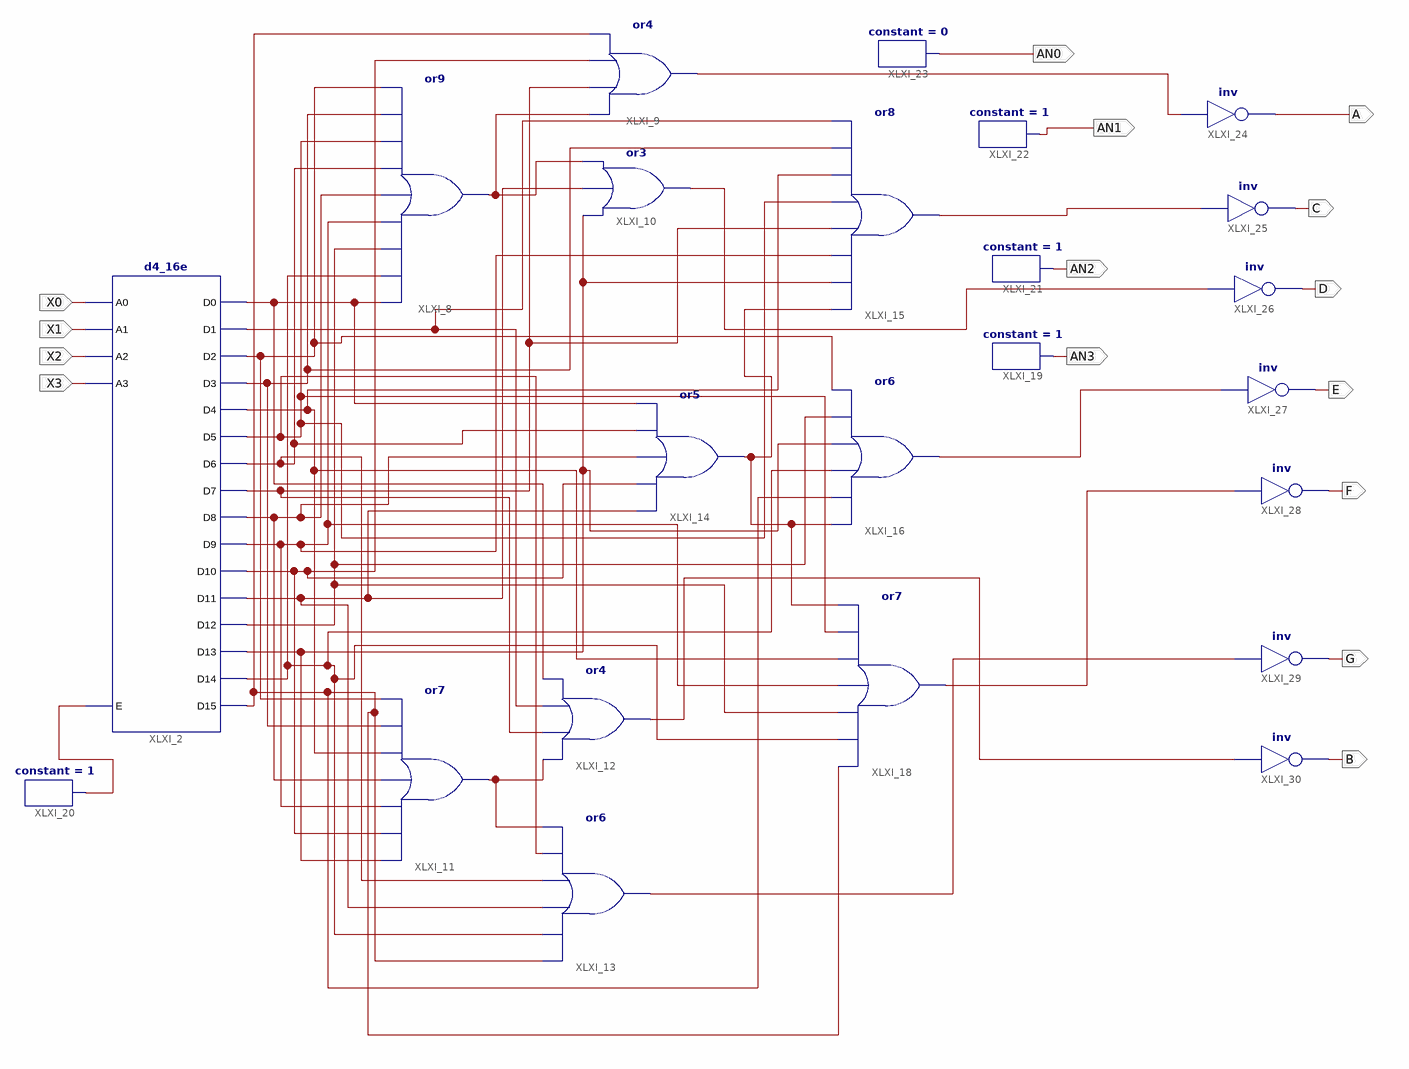
[diagram p0: schematic sheet 1]
// Xilinx ISE schematic Assignment3.sch (spartan6) as structural Verilog: 23 symbols, 15 ports
module Assignment3 (
  input  X0,
  input  X1,
  input  X2,
  input  X3,
  output AN0,
  output AN1,
  output AN2,
  output AN3,
  output A,
  output C,
  output E,
  output D,
  output F,
  output G,
  output B
);

  wire XLXN_10, XLXN_11, XLXN_14, XLXN_15, XLXN_17, XLXN_20, XLXN_22, XLXN_23, XLXN_25, XLXN_26, XLXN_27,
       XLXN_28, XLXN_29, XLXN_30, XLXN_31, XLXN_33, XLXN_34, XLXN_37, XLXN_40, XLXN_49, XLXN_56, XLXN_57,
       XLXN_64, XLXN_65, XLXN_66, XLXN_67, XLXN_69;

  d4_16e XLXI_2 (
    .A0(X0), .A1(X1), .A2(X2), .A3(X3), .E(XLXN_49), .D0(XLXN_37), .D1(XLXN_34), .D10(XLXN_30),
    .D11(XLXN_23), .D12(XLXN_14), .D13(XLXN_31), .D14(XLXN_15), .D15(XLXN_22), .D2(XLXN_25), .D3(XLXN_26),
    .D4(XLXN_27), .D5(XLXN_10), .D6(XLXN_11), .D7(XLXN_20), .D8(XLXN_28), .D9(XLXN_29));
  or XLXI_8 (XLXN_17, XLXN_37, XLXN_15, XLXN_14, XLXN_29, XLXN_28, XLXN_11, XLXN_10, XLXN_26, XLXN_25);
  or XLXI_9 (XLXN_69, XLXN_17, XLXN_20, XLXN_30, XLXN_22);
  or XLXI_10 (XLXN_64, XLXN_31, XLXN_23, XLXN_17);
  or XLXI_11 (XLXN_33, XLXN_31, XLXN_30, XLXN_29, XLXN_28, XLXN_27, XLXN_26, XLXN_25);
  or XLXI_12 (XLXN_67, XLXN_33, XLXN_20, XLXN_34, XLXN_37);
  or XLXI_13 (XLXN_66, XLXN_22, XLXN_15, XLXN_23, XLXN_11, XLXN_10, XLXN_33);
  or XLXI_14 (XLXN_40, XLXN_23, XLXN_30, XLXN_28, XLXN_11, XLXN_37);
  or XLXI_15 (XLXN_56, XLXN_40, XLXN_31, XLXN_29, XLXN_20, XLXN_10, XLXN_27, XLXN_26, XLXN_34);
  or XLXI_16 (XLXN_57, XLXN_40, XLXN_22, XLXN_15, XLXN_31, XLXN_14, XLXN_25);
  or XLXI_18 (XLXN_65, XLXN_22, XLXN_15, XLXN_14, XLXN_29, XLXN_27, XLXN_10, XLXN_40);
  constant #(.CValue("1")) XLXI_19 (.O(AN3));
  constant #(.CValue("1")) XLXI_20 (.O(XLXN_49));
  constant #(.CValue("1")) XLXI_21 (.O(AN2));
  constant #(.CValue("1")) XLXI_22 (.O(AN1));
  constant #(.CValue("0")) XLXI_23 (.O(AN0));
  not XLXI_24 (A, XLXN_69);
  not XLXI_25 (C, XLXN_56);
  not XLXI_26 (D, XLXN_64);
  not XLXI_27 (E, XLXN_57);
  not XLXI_28 (F, XLXN_65);
  not XLXI_29 (G, XLXN_66);
  not XLXI_30 (B, XLXN_67);
endmodule
